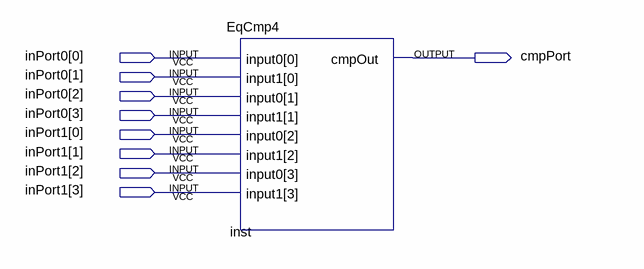
[diagram p0: schematic sheet]
// Quartus schematic EqCmpDemo.bdf as structural Verilog: 1 symbols, 9 pins
module EqCmpDemo (
  input  [3:0] inPort0,
  input  [3:0] inPort1,
  output cmpPort
);

  EqCmp4 inst (
    .input0({inPort1[2], inPort1[0], inPort0[2], inPort0[0]}),
    .input1({inPort1[3], inPort1[1], inPort0[3], inPort0[1]}), .cmpOut(cmpPort));
endmodule
